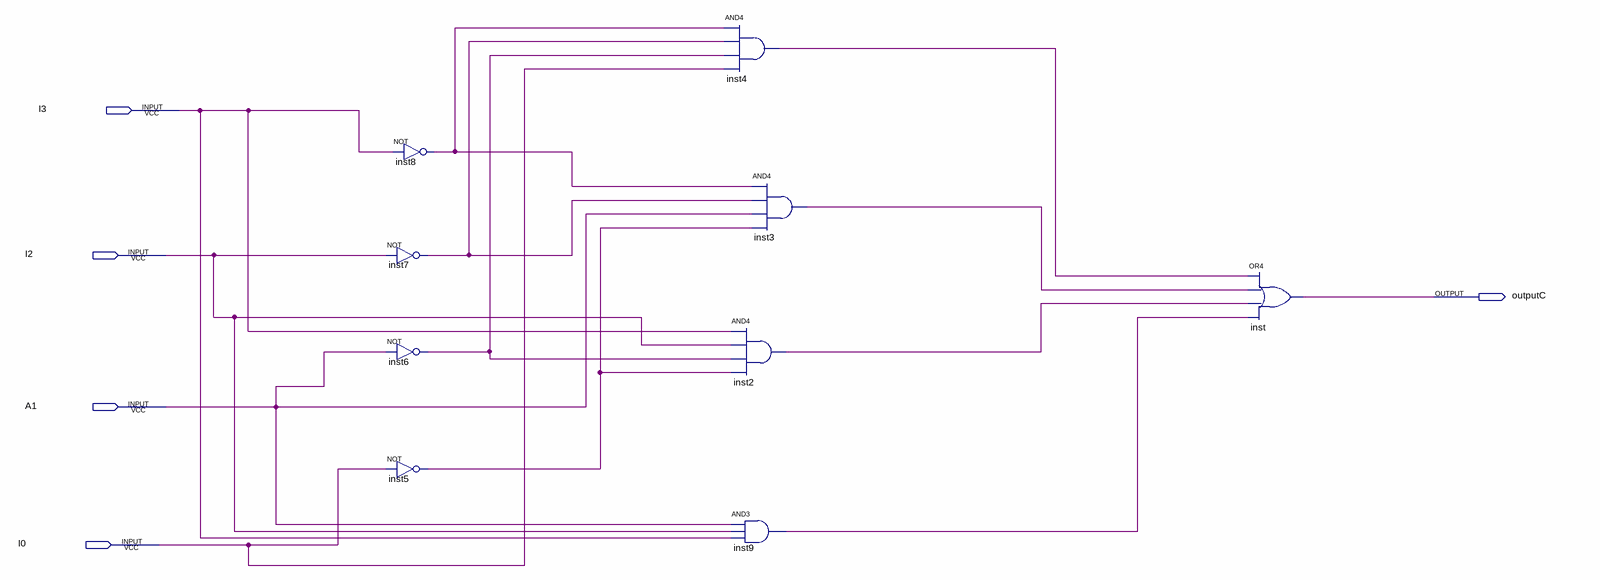
[diagram p0: schematic sheet]
// Quartus schematic outputC.bdf as structural Verilog: 9 symbols, 5 pins
module outputC (
  input  I3,
  input  I2,
  input  A1,
  input  I0,
  output outputC
);

  wire inst2_out, inst3_out, inst4_out, inst5_out, inst6_out, inst7_out, inst8_out, inst9_out;

  not inst8 (inst8_out, I3);
  not inst7 (inst7_out, I2);
  not inst6 (inst6_out, A1);
  not inst5 (inst5_out, I0);
  and inst4 (inst4_out, inst8_out, inst7_out, inst6_out, I0);
  and inst3 (inst3_out, inst8_out, inst7_out, A1, inst5_out);
  and inst2 (inst2_out, I3, I2, inst6_out, inst5_out);
  and inst9 (inst9_out, A1, I2, I3);
  or inst (outputC, inst4_out, inst3_out, inst2_out, inst9_out);
endmodule
